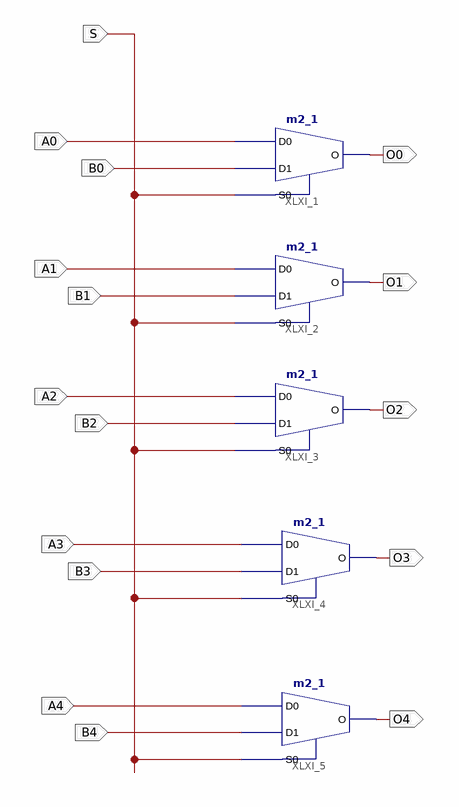
[diagram p0: schematic sheet 1]
// Xilinx ISE schematic mux5.sch (artix7) as structural Verilog: 5 symbols, 16 ports
module mux5 (
  input  S,
  input  A0,
  input  A1,
  input  A2,
  input  A3,
  input  A4,
  input  B0,
  input  B1,
  input  B2,
  input  B3,
  input  B4,
  output O0,
  output O1,
  output O2,
  output O3,
  output O4
);

  m2_1 XLXI_1 (.D0(A0), .D1(B0), .S0(S), .O(O0));
  m2_1 XLXI_2 (.D0(A1), .D1(B1), .S0(S), .O(O1));
  m2_1 XLXI_3 (.D0(A2), .D1(B2), .S0(S), .O(O2));
  m2_1 XLXI_4 (.D0(A3), .D1(B3), .S0(S), .O(O3));
  m2_1 XLXI_5 (.D0(A4), .D1(B4), .S0(S), .O(O4));
endmodule
